# Altium schematic sheet [02].PSU.SchDoc
size A; Organization: Altium Limited; Address1: L3, 12a Rodborough Rd; Address2: Frenchs Forest; Address3: NSW; Address4: Australia 2086
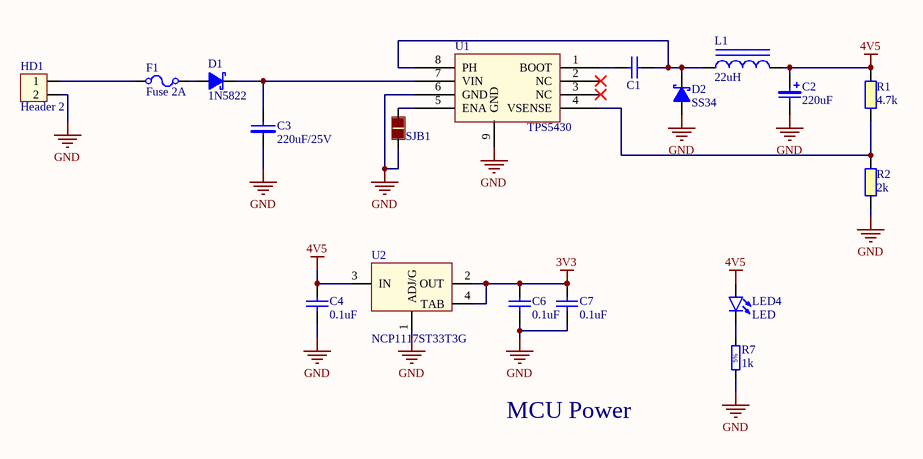
[diagram p0: [02].PSU.SchDoc]

## Parts
C1  0.01uF  [C_0603]  (value not drawn)
C2  220uF  [Tantalum]
C3  220uF/25V  [CAP-ALU-SMD-6.3x7.7x2.2]
C4  0.1uF  [C_0603]
C6  0.1uF  [C_0603]
C7  0.1uF  [C_0603]
D1  1N5822  [SS34]
D2  SS34  [SS34]
F1  Fuse 2A  [FUSE_1812_4530]
HD1  Header 2  [HED2]
L1  22uH  [INDUCTOR]
LED4  LED  [LED_0805]
R1  4.7k  [R_0603]
R2  2k  [R_0603]
R7  1k  [R_0603]
SJB1  SJB_SMD_2_0603  [SJB]  (value not drawn)
U1  TPS5430  [TPS5430]
U2  NCP1117ST33T3G  [AMS1117]

## Nets
3V3: C6.2 C7.2 U2.2(OUT) U2.4(TAB)
4V5: C2.A C4.2 L1.2 LED4.A R1.2 U2.3(IN)
GND: C2.K C3.1 C4.1 C6.1 C7.1 D2.A HD1.2 R2.1 R7.1 SJB1.1 U1.6(GND) U1.9(GND) U2.1(ADJ/G)
NetC1_1: C1.1 U1.1(BOOT)
NetC1_2: C1.2 D2.K L1.1 U1.8(PH)
NetC3_2: C3.2 D1.K U1.7(VIN)
NetD1_A: D1.A F1.2
NetF1_1: F1.1 HD1.1
NetLED4_K: LED4.K R7.2
NetR1_1: R1.1 R2.2 U1.4(VSENSE)
NetSJB1_2: SJB1.2 U1.5(ENA)

Not connected (* = marked no-connect by the designer): U1 2(NC)* 3(NC)*

## Notes on the sheet
- MCU Power
- Title
- Size:
- Date:
- A
- Number:
- Time:
- Revision:
- Sheet
- of
- File:
- (in symbol RC0805JR-071KL) 5%

## Library data of the parts
C1 = CAP_0603
C2 = CAP_TANTA
C3 = Cap 220uF/25V: PANASONIC EEU-TP1E221B CAPACITOR ALUM ELEC, 220UF, 25V, 20%, RADIAL (1 piece)
C4 C6 C7 = CAP_0805
D1 = DIODE_1N5822: 3A 40V SS34
D2 = SS34: DIODE SCHOTTKY 40V 3A SMC; Manufacturer: ON Semiconductor / Fairchild; Element Configuration: Single; Polarity: Standard; Peak Reverse Current: 500uA; Max Surge Current: 100A; Forward Voltage: 500mV; Number of Elements: 1; Max Power Dissipation: 2.27W; Supplier 1: RSComponents; Manufacturer Part Number: SS34; Stock 1: 0; Mount: Surface Mount; Case/Package: SMC; Number of Pins: 2; Contact Plating: Matte,Tin; Number of Terminals: 2; Min Operating Temperature: -55°C; Max Operating Temperature: 150°C; Packaging: Tape and Reel; Output Current: 3A; Package Quantity: 1; Voltage Rating (DC): 40V; Current Rating: 3A; Forward Current: 3A; Max Repetitive Reverse Voltage (Vrrm): 40V; Max Reverse Leakage Current: 500uA; Peak Non-Repetitive Surge Current: 100A; Max Forward Surge Current (Ifsm): 100A; Current: 3A; Voltage: 40V; Average Rectified Current: 3A; Max Reverse Voltage (DC): 40V; Length: 7.15mm; Height: 2.75mm; Width: 6.25mm; Radiation Hardening: No; REACH SVHC: No SVHC; Lead Free: Lead Free; ComponentLink1URL: https://www.fairchildsemi.com/datasheets/SS/SS39.pdf?src-supplier=Avnet; ComponentLink1Description: https://www.fairchildsemi.com/datasheets/SS/SS39.pdf?src-supplier=Avnet; ComponentLink2URL: http://www.mouser.com/ds/2/149/SS34-197057.pdf?src-supplier=Mouser; ComponentLink2Description: http://www.mouser.com/ds/2/149/SS34-197057.pdf?src-supplier=Mouser; ComponentLink3URL: http://www.jameco.com/Jameco/Products/ProdDS/1090087.pdf?src-supplier=Jameco; ComponentLink3Description: http://www.jameco.com/Jameco/Products/ProdDS/1090087.pdf?src-supplier=Jameco; ComponentLink4URL: https://www.fairchildsemi.com/package-drawings/DO/DO214AB.pdf?src-supplier=Digi-Key; ComponentLink4Description: https://www.fairchildsemi.com/package-drawings/DO/DO214AB.pdf?src-supplier=Digi-Key; ComponentLink5URL: http://www.farnell.com/datasheets/1774678.pdf?src-supplier=Element14; ComponentLink5Description: http://www.farnell.com/datasheets/1774678.pdf?src-supplier=Element14; ComponentLink6URL: http://www.jameco.com/Jameco/Products/ProdDS/1547649.pdf?src-supplier=Jameco; ComponentLink6Description: http://www.jameco.com/Jameco/Products/ProdDS/1547649.pdf?src-supplier=Jameco; Supplier Part Number 1: 1662321
F1 = FUSE_SMD
HD1 = Hed2: Header 2 (Green); Value: Header 2
L1 = INDUCTOR
LED4 = LED_0805
R1 R2 = RES_0603
R7 = RC0805JR-071KL: Resistor - 5%; Part Description: General Purpose Chip Resistor; Manufacturer: Yageo; ID: 2; Power: 125 mW (1/8 W); TC: 100 PPM / C; Part Number: RC0805JR-071KL; Value: 1k; Component Kind: Standard; Component Type: Standard; Footprint: RESC2012X60N; Pin Count: 2; Status: Not recommended; Tolerance: ±5%; Manufacturer Part Number: RC0805JR-071KL; Case: 0805; Mounted: Yes; Socket: No; SMD: Yes; Author: MDBK
U2 = NCP1117ST33T3G: IC REG LINEAR 3.3V 1A SOT223